# EAGLE schematic MinieasySens-RFM_V03-Build001 (EAGLE 7.6.0)
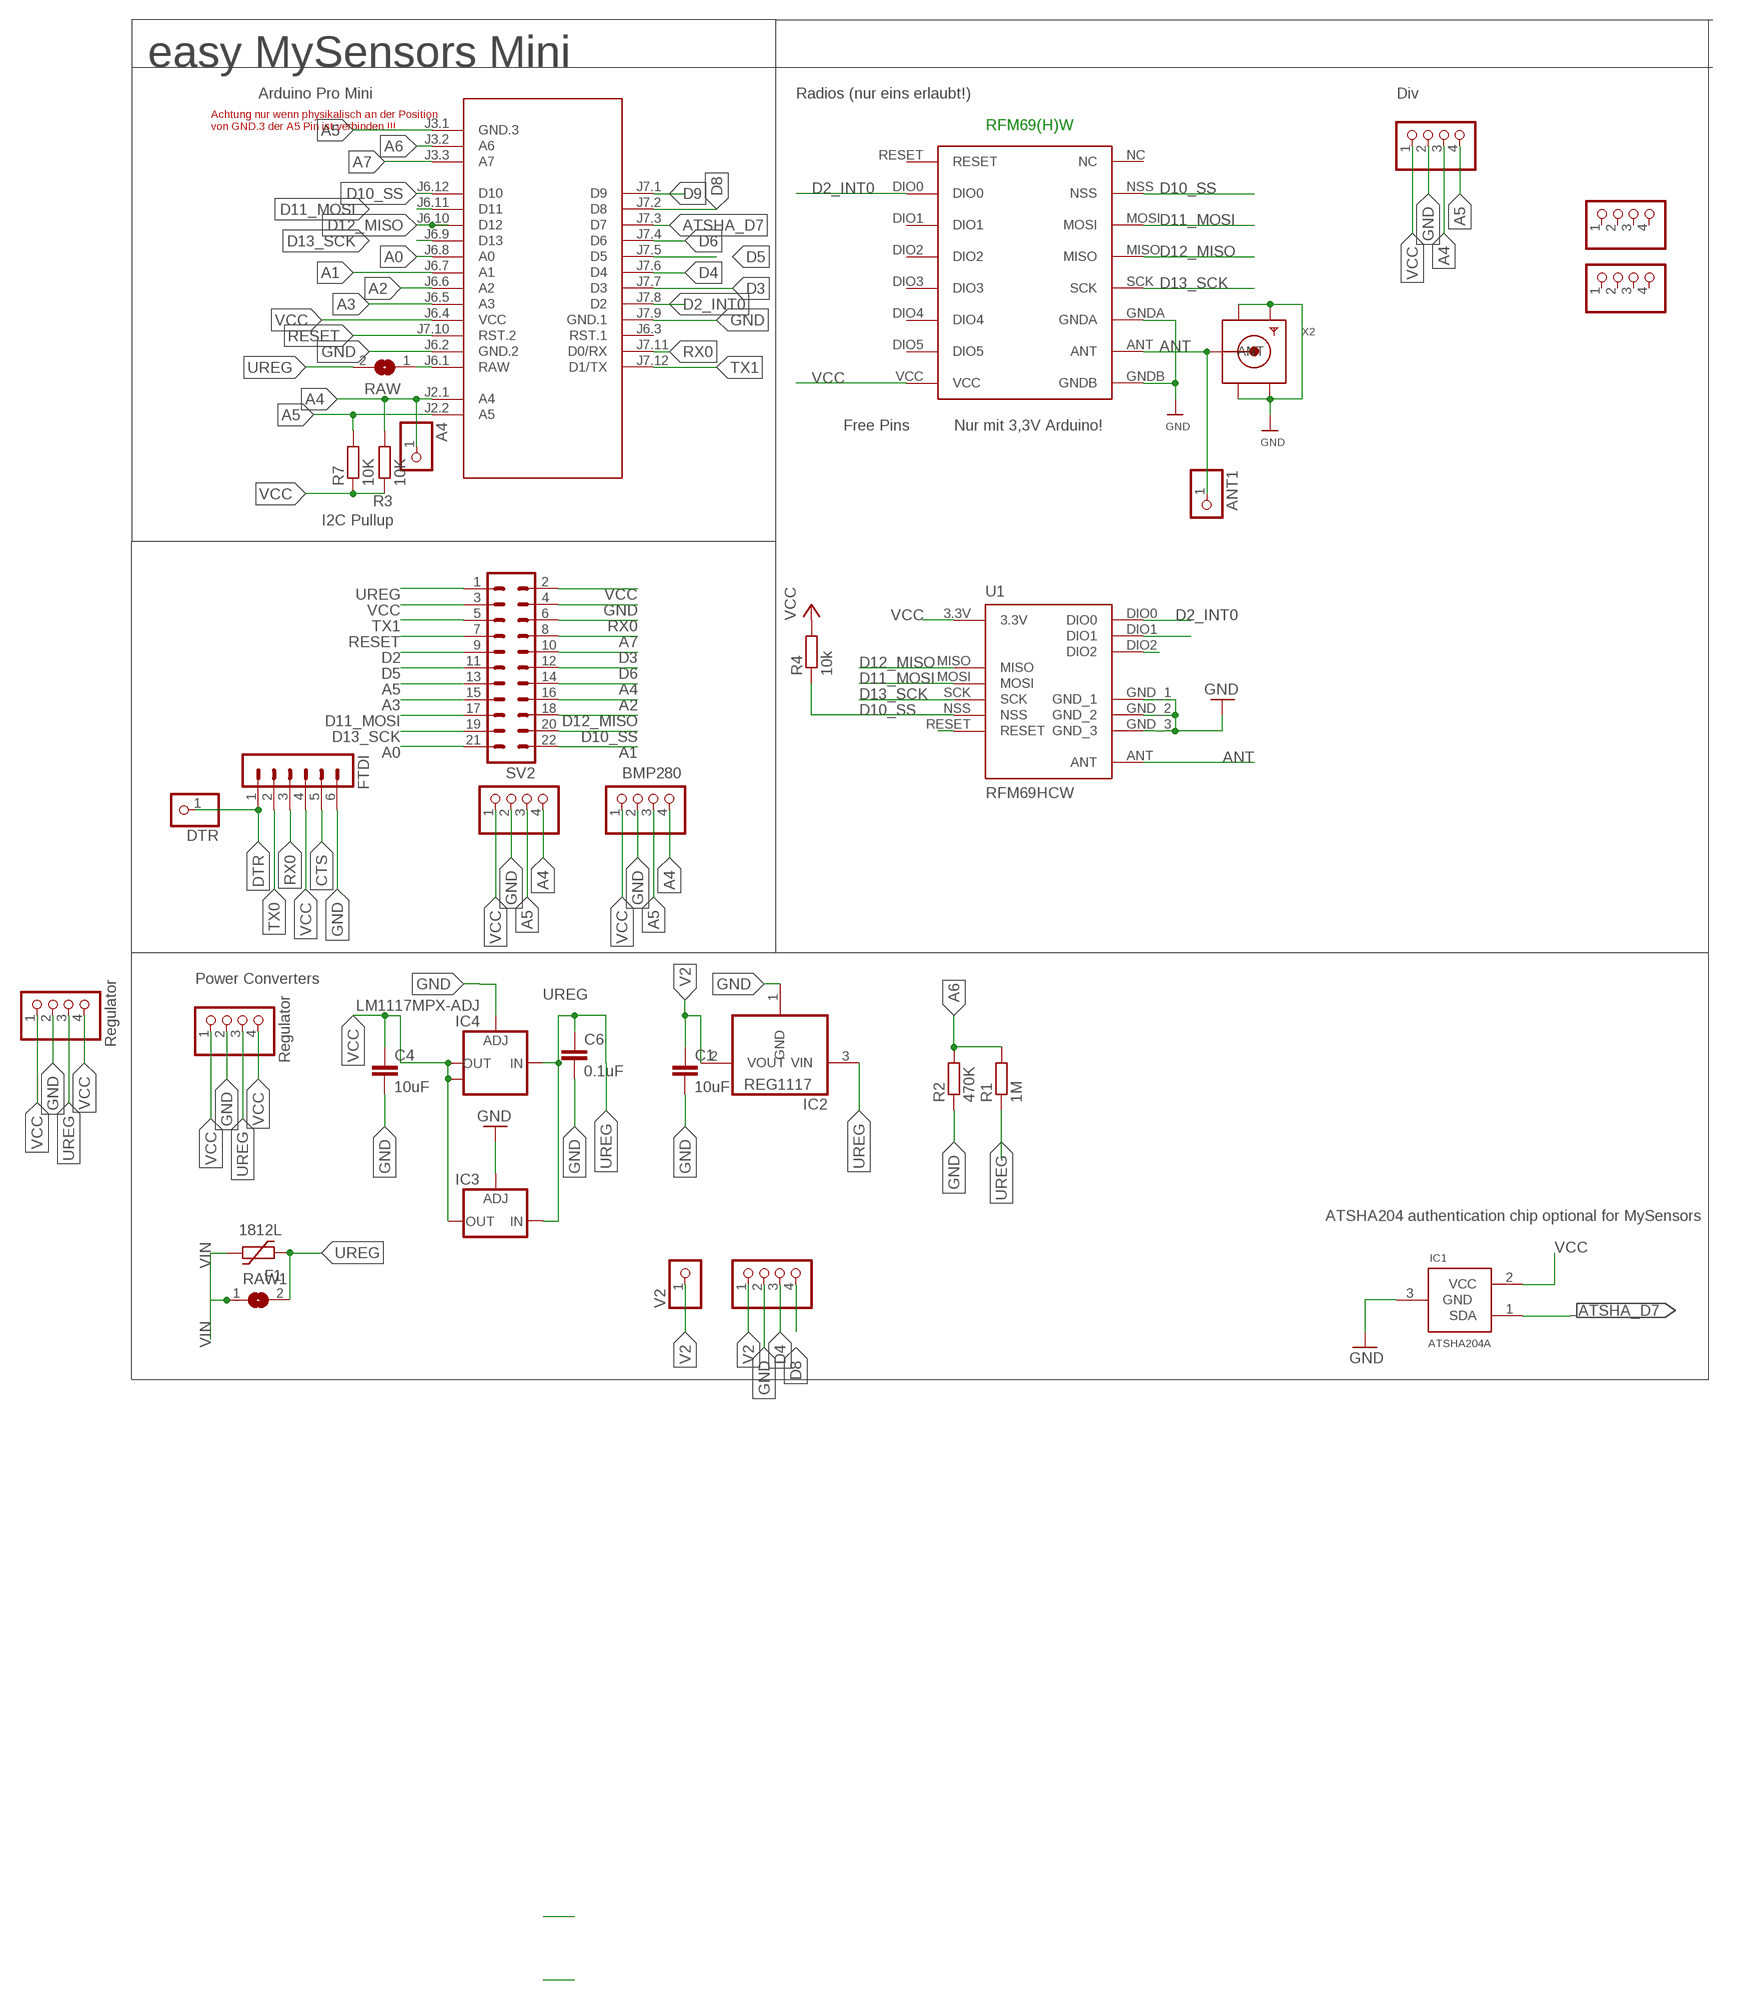
[diagram p0: schematic, sheet 1, part 1 of 2]
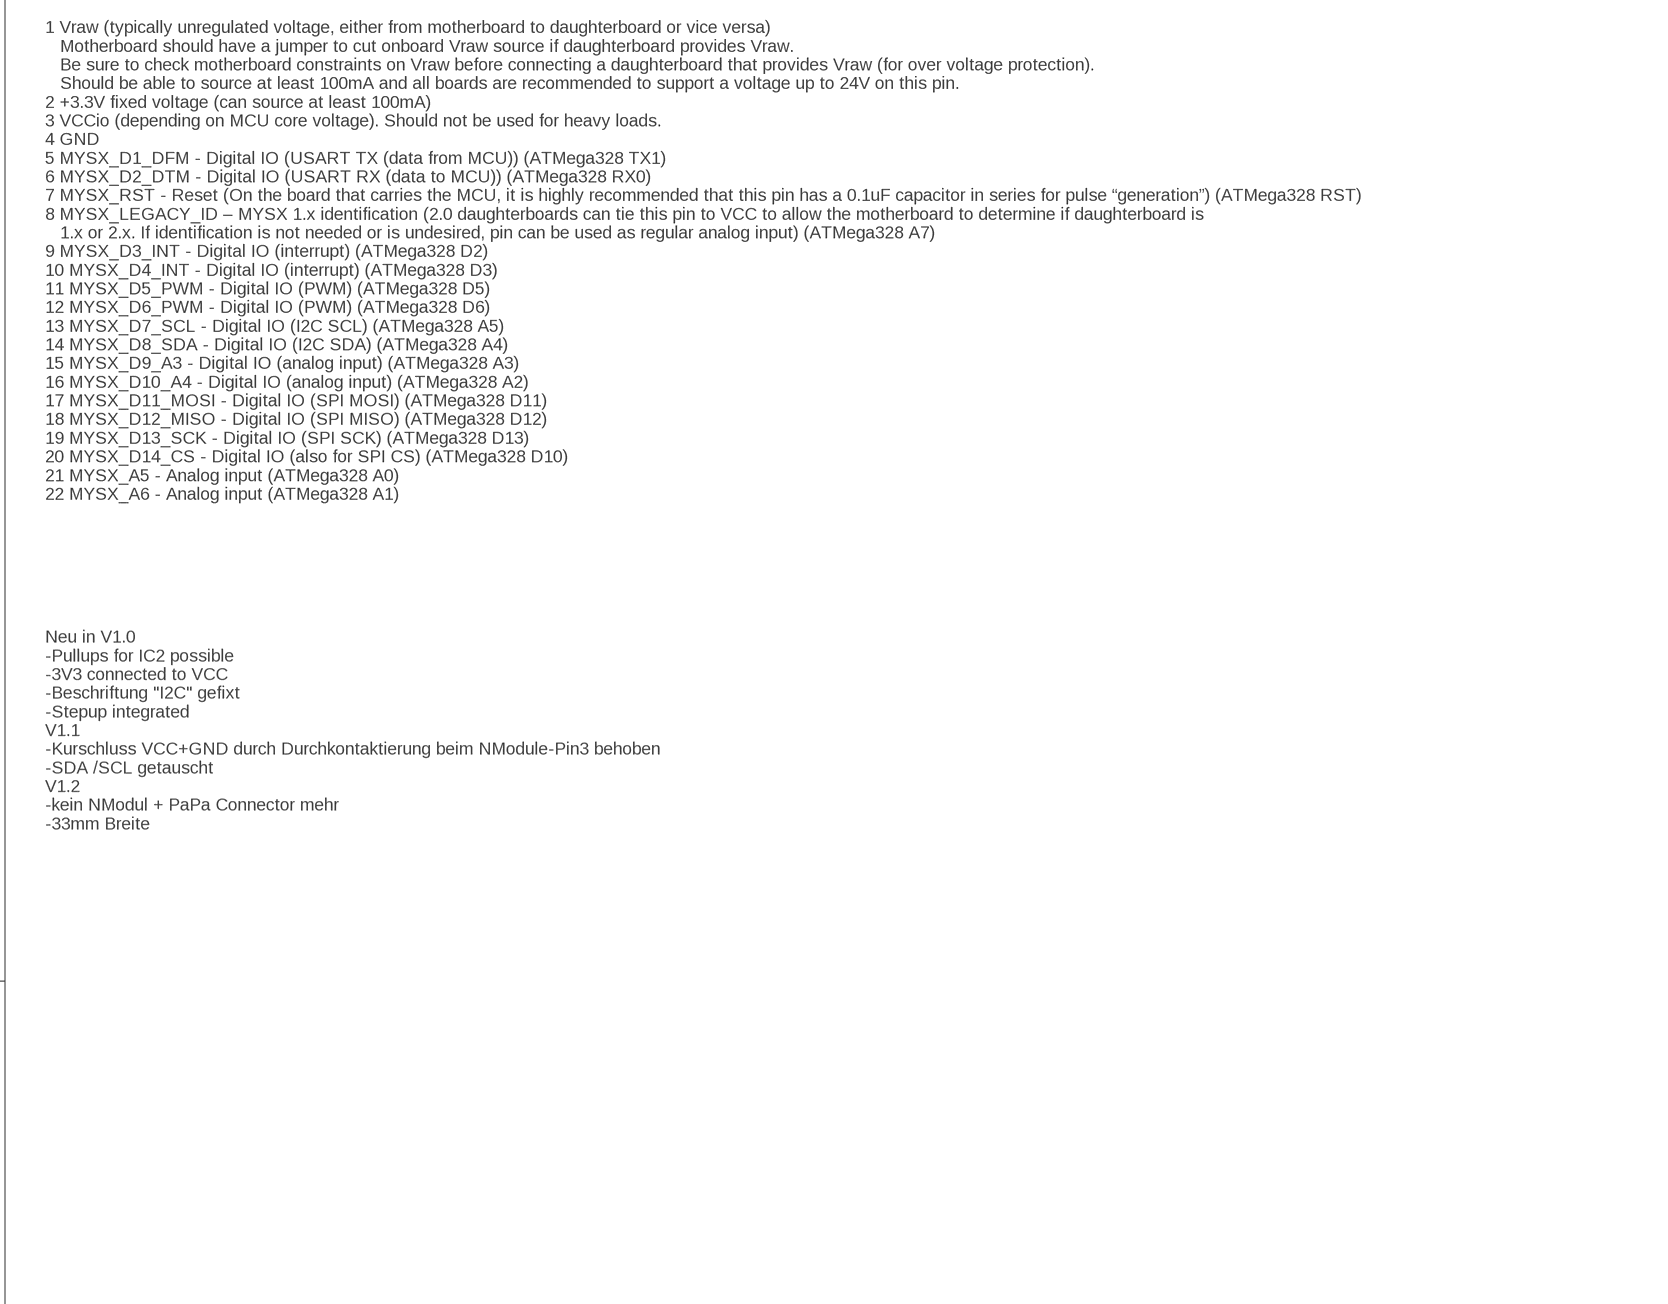
[diagram p1: schematic, sheet 1, part 2 of 2]

## Parts
A4  PINHD-1X1  [1X01]
ANT1  PINHD-1X1  [1X01]
BH1750  PINHD-1X04_2.54-S  [1X04-S]
C1  10uF  C-EUC1210  [C1210]
C4  10uF  C-EUC1210  [C1210]
C6  0.1uF  C-EUC1206  [C1206]
DTR  PINHD-1X1  [1X01]
F1  1812L  [1812L]
FTDI  MA06-1  [MA06-1]
I2C-1  PINHD-1X04_2.54-S  [1X04-S]
I2C-2  PINHD-1X04_2.54-S  [1X04-S]
IC1  ATSHA204A  [SOT23]
IC2  REG1117  [SOT223]
IC3  LD117ADT50TR  [DPACK]
IC4  LM1117MPX-ADJ  [SOT223]
JP1  PINHD-1X04_2.54-S  [1X04-S]
JP2  PINHD-1X04_2.54-S  [1X04-S]
M1  ARDUINO-PRO-MINI-3.3V#NP  [ARDUINO-PRO-MINI#NP]
R1  1M  R-EU_R0805  [R0805]
R2  470K  R-EU_R0805  [R0805]
R3  10K  R-EU_R0805  [R0805]
R4  10k  R-EU_M0805  [M0805]
R7  10K  R-EU_R0805  [R0805]
RAW  SJ  [SJ]
RAW1  SJ  [SJ]
RFM69W  RFM69HW  [RFM]
STEPDWN  PINHD-1X04_2.54-S  [1X04-S]
STEPDWN1  PINHD-1X04_2.54-S  [1X04-S]
SV2  MA11-2  [MA11-2]
U1  RFM69HCW  [RFM69HCW-XXXS2]
V2  PINHD-1X1  [1X01]
V2-  PINHD-1X04_2.54-S  [1X04-S]
X2  SMACONNECTOR_EDGE  [SMA_EDGELAUNCH]

## Nets
A0: M1.J6.8(A0) SV2.21
A1: M1.J6.7(A1) SV2.22
A2: M1.J6.6(A2) SV2.16
A3: M1.J6.5(A3) SV2.15
A4: A4.1 BH1750.4 I2C-1.4 I2C-2.3 M1.J2.1(A4) R3.2 SV2.14
A5: BH1750.3 I2C-1.3 I2C-2.4 M1.J2.2(A5) M1.J3.1(GND.3) R7.2 SV2.13
A6: M1.J3.2(A6) R1.2 R2.2
A7: M1.J3.3(A7) SV2.8
ANT: ANT1.1 RFM69W.ANT U1.ANT X2.P(ANT)
ATSHA_D7: IC1.1(SDA) M1.J7.3(D7)
CTS: FTDI.5
D2: SV2.9
D2_INT0: M1.J7.8(D2) RFM69W.DIO0 U1.DIO0
D3: M1.J7.7(D3) SV2.10
D4: M1.J7.6(D4) V2-.3
D5: M1.J7.5(D5) SV2.11
D6: M1.J7.4(D6) SV2.12
D8: M1.J7.2(D8) V2-.4
D9: M1.J7.1(D9)
D10_SS: M1.J6.12(D10) R4.1 RFM69W.NSS SV2.20 U1.NSS
D11_MOSI: M1.J6.11(D11) RFM69W.MOSI SV2.17 U1.MOSI
D12_MISO: M1.J6.10(D12) RFM69W.MISO SV2.18 U1.MISO
D13_SCK: M1.J6.9(D13) RFM69W.SCK SV2.19 U1.SCK
DTR: DTR.1 FTDI.1
GND [PWR]: BH1750.2 C1.2 C4.2 C6.2 FTDI.6 I2C-1.2 I2C-2.2 IC1.3(GND) IC2.1(GND) IC3.1(ADJ) IC4.1(ADJ) M1.J6.2(GND.2) M1.J7.9(GND.1) R2.1 RFM69W.GNDA RFM69W.GNDB STEPDWN1.2 STEPDWN.2 SV2.4 U1.GND_1 U1.GND_2 U1.GND_3 V2-.2 X2.GND@1(GND4) X2.GND@2(GND3) X2.GND@3(GND2) X2.GND@4(GND1)
N$3: U1.RESET
N$14: U1.DIO2
N$15: U1.DIO1
RAW [PWR]: M1.J6.1(RAW) RAW.1
RESET: M1.J7.10(RST.2) SV2.7
RX0: FTDI.3 M1.J7.11(D0/RX) SV2.6
TX0: FTDI.2
TX1: M1.J7.12(D1/TX) SV2.5
UREG [PWR]: C6.1 F1.P$1 IC2.3(VIN) IC3.3(IN) IC4.3(IN) R1.1 RAW1.2 RAW.2 STEPDWN1.3 STEPDWN.3 SV2.1
V2 [PWR]: C1.1 IC2.2(VOUT) V2-.1 V2.1
VCC [PWR]: BH1750.1 C4.1 FTDI.4 I2C-1.1 I2C-2.1 IC1.2(VCC) IC3.4(OUT) IC4.2(OUT) IC4.TAB(OUT1) M1.J6.4(VCC) R3.1 R4.2 R7.1 RFM69W.VCC STEPDWN1.1 STEPDWN1.4 STEPDWN.1 STEPDWN.4 SV2.2 SV2.3 U1.3.3V
VIN [PWR]: F1.P$2 RAW1.1
Unconnected: JP1.1 JP1.2 JP1.3 JP1.4 JP2.1 JP2.2 JP2.3 JP2.4 M1.J6.3(RST.1) RFM69W.DIO1 RFM69W.DIO2 RFM69W.DIO3 RFM69W.DIO4 RFM69W.DIO5 RFM69W.NC RFM69W.RESET

## Notes on the sheet
- easy MySensors Mini
- Arduino Pro Mini | Radios (nur eins erlaubt!) | Div
- Achtung nur wenn physikalisch an der Position 
  von GND.3 der A5 Pin ist verbinden !!!
- RFM69(H)W
- Free Pins | Nur mit 3,3V Arduino!
- I2C Pullup
- 1 Vraw (typically unregulated voltage, either from motherboard to daughterboard or vice versa)
     Motherboard should have a jumper to cut onboard Vraw source if daughterboard provides Vraw. 
     Be sure to check motherboard constraints on Vraw before connecting a daughterboard that provides Vraw (for over voltage protection). 
     Should be able to source at least 100mA and all boards are recommended to support a voltage up to 24V on this pin.
  2 +3.3V fixed voltage (can source at least 100mA)
  3 VCCio (depending on MCU core voltage). Should not be used for heavy loads.
  4 GND
  5 MYSX_D1_DFM - Digital IO (USART TX (data from MCU)) (ATMega328 TX1)
  6 MYSX_D2_DTM - Digital IO (USART RX (data to MCU)) (ATMega328 RX0)
  7 MYSX_RST - Reset (On the board that carries the MCU, it is highly recommended that this pin has a 0.1uF capacitor in series for pulse “generation”) (ATMega328 RST)
  8 MYSX_LEGACY_ID – MYSX 1.x identification (2.0 daughterboards can tie this pin to VCC to allow the motherboard to determine if daughterboard is 
     1.x or 2.x. If identification is not needed or is undesired, pin can be used as regular analog input) (ATMega328 A7)
  9 MYSX_D3_INT - Digital IO (interrupt) (ATMega328 D2)
  10 MYSX_D4_INT - Digital IO (interrupt) (ATMega328 D3)
  11 MYSX_D5_PWM - Digital IO (PWM) (ATMega328 D5)
  12 MYSX_D6_PWM - Digital IO (PWM) (ATMega328 D6)
  13 MYSX_D7_SCL - Digital IO (I2C SCL) (ATMega328 A5)
  14 MYSX_D8_SDA - Digital IO (I2C SDA) (ATMega328 A4)
  15 MYSX_D9_A3 - Digital IO (analog input) (ATMega328 A3)
  16 MYSX_D10_A4 - Digital IO (analog input) (ATMega328 A2)
  17 MYSX_D11_MOSI - Digital IO (SPI MOSI) (ATMega328 D11)
  18 MYSX_D12_MISO - Digital IO (SPI MISO) (ATMega328 D12)
  19 MYSX_D13_SCK - Digital IO (SPI SCK) (ATMega328 D13)
  20 MYSX_D14_CS - Digital IO (also for SPI CS) (ATMega328 D10)
  21 MYSX_A5 - Analog input (ATMega328 A0)
  22 MYSX_A6 - Analog input (ATMega328 A1)
- BMP280
- Neu in V1.0
  -Pullups for IC2 possible
  -3V3 connected to VCC
  -Beschriftung "I2C" gefixt
  -Stepup integrated
  V1.1
  -Kurschluss VCC+GND durch Durchkontaktierung beim NModule-Pin3 behoben
  -SDA /SCL getauscht
  V1.2
  -kein NModul + PaPa Connector mehr
  -33mm Breite
- Power Converters
- Regulator
- Regulator
- ATSHA204 authentication chip optional for MySensors

## Library data of the parts
A4 ANT1 DTR V2 = pinhead:PINHD-1X1: PIN HEADER
BH1750 I2C-1 I2C-2 JP1 JP2 STEPDWN STEPDWN1 V2- = pinhead-2:PINHD-1X04: PIN HEADER
C1 C4 C6 = rcl:C-EU: CAPACITOR, European symbol
F1 = ptc-littlefuse:1812L
FTDI = con-lstb:MA06-1: PIN HEADER; OC_FARNELL: unknown; OC_NEWARK: unknown
IC1 = Sensor:ATSHA204A
IC2 = burr-brown:REG1117: 800mA and 1A Low Dropout (LDO) Positive Regulator 1.8V, 2.5V, 2.85V, 3.3V, 5V, and Adj; MPN: REG1117; OC_FARNELL: 1097566; OC_NEWARK: 14P6981
IC3 = v-reg:LD117A?*: Low drop fixed and adjustable positive voltage regulators 1 A Source: http://www.st.com/stonline/products/literature/ds/7194/ld1117axx.pdf
IC4 = lm1117:LM1117MPX-ADJ
M1 = diy-modules:ARDUINO-PRO-MINI-*#NP: Arduino Pro Mini without programming pads
R1-R4 R7 = rcl:R-EU_: RESISTOR, European symbol
RAW RAW1 = jumper:SJ: SMD solder JUMPER
RFM69W = hoperf:RFM69HW
SV2 = con-Pinheader:MA11-2: PIN HEADER; OC_FARNELL: unknown; OC_NEWARK: unknown
U1 = doug:RFM69H
X2 = adafruit:SMACONNECTOR: SMA Connector 90° DIP SMA Connector, 50 Ohm (4UConnector: 07259)

## Net classes
0 default: width 0.254 mm, clearance 0.205 mm
1 PWR: width 0.406 mm, clearance 0.205 mm to class 0, clearance 0.205 mm